# EAGLE design single100 (EAGLE 6.6.0)
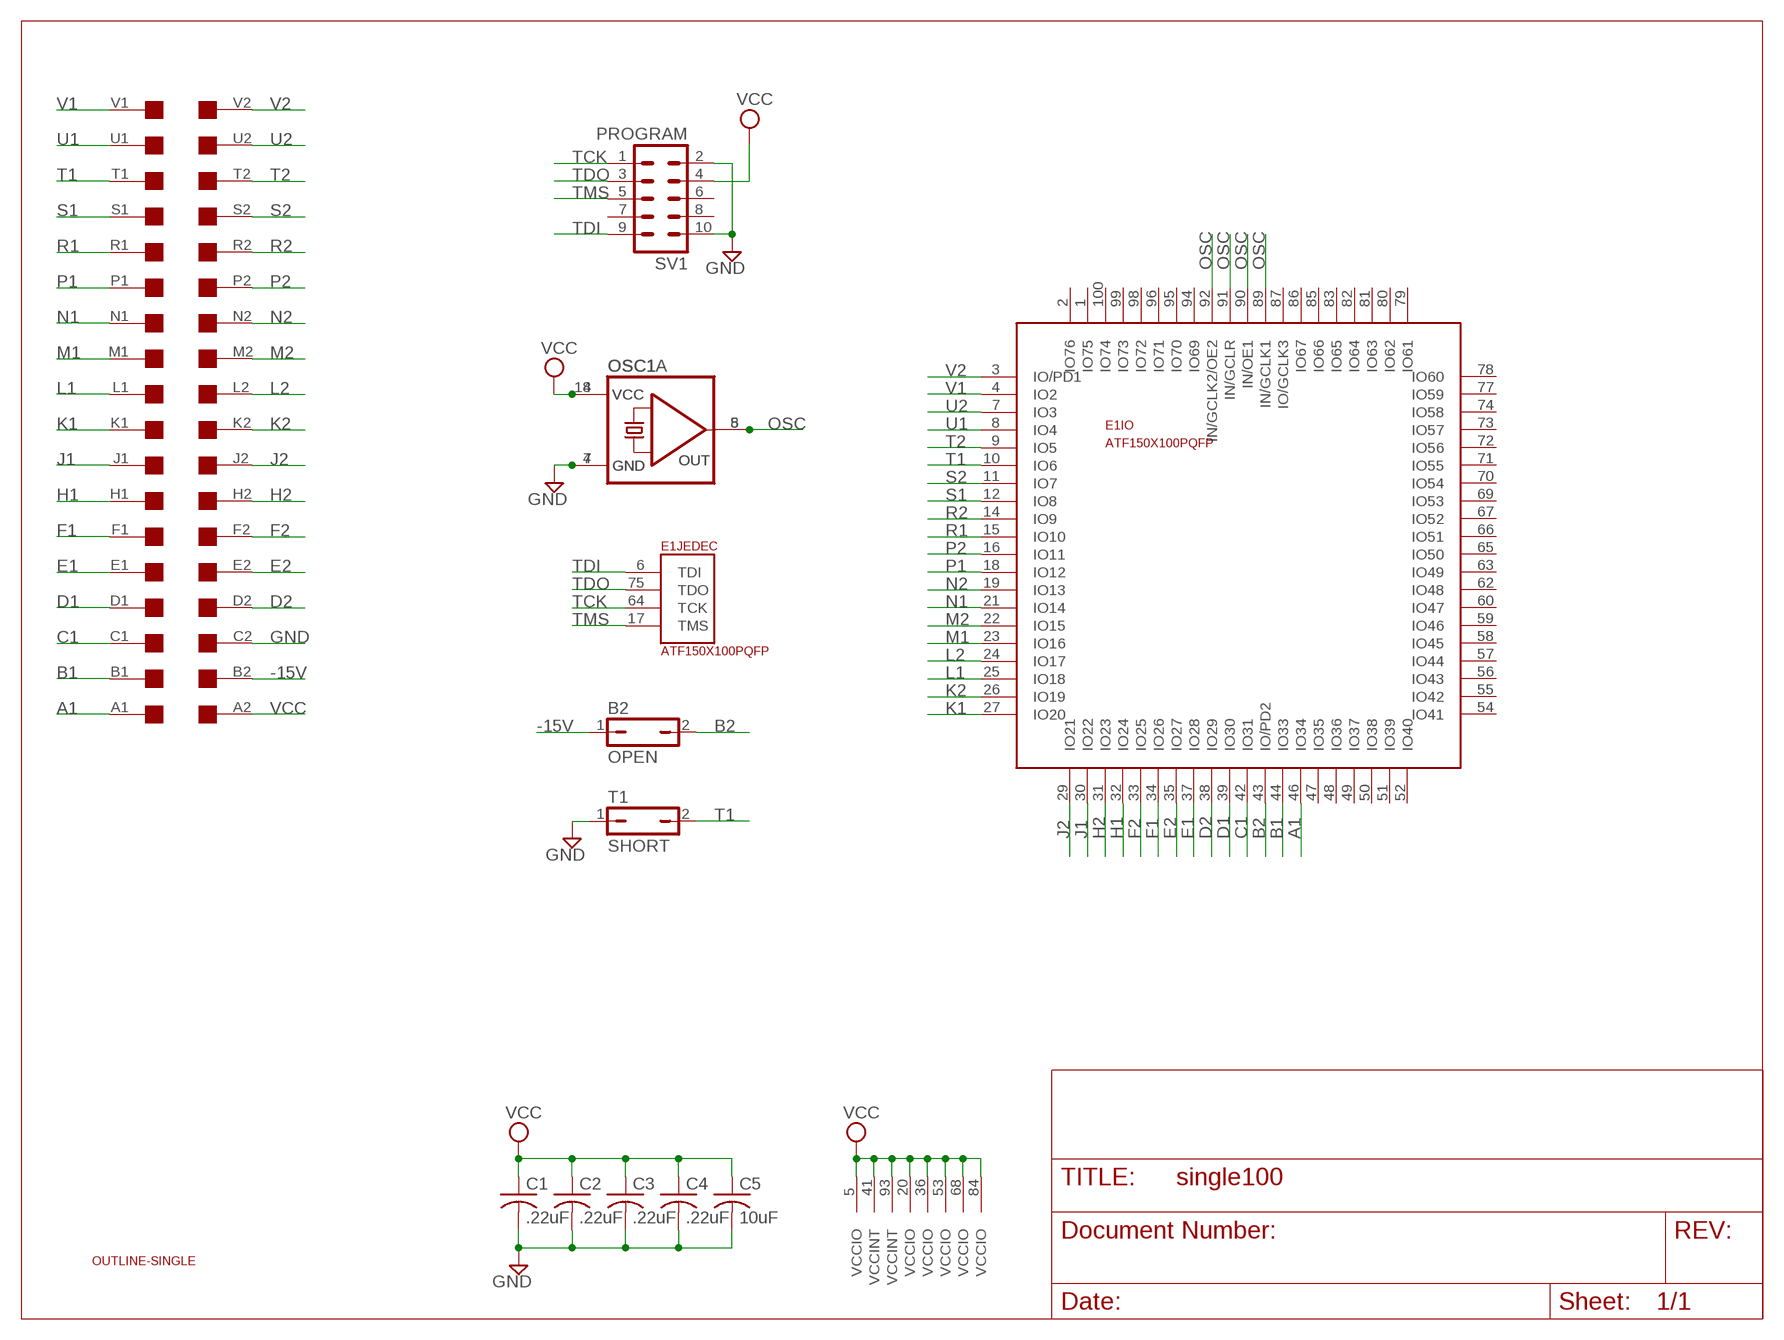
[diagram p0: schematic, sheet 1]

## Parts
B2  OPEN  JP1Q  [JP1]
C1  .22uF  C-USC0805  [C0805]
C2  .22uF  C-USC0805  [C0805]
C3  .22uF  C-USC0805  [C0805]
C4  .22uF  C-USC0805  [C0805]
C5  10uF  C-USC0805  [C0805]
E1  ATF150X100PQFP  [PQFP-100]
OSC1  QG5460  [DIL08S]
OSC1A  QG5860  [DIL14S]
SV1  PROGRAM  ML10  [ML10]
T1  SHORT  JP1Q  [JP1]
U$1  OUTLINE-SINGLE  [SINGLE]
U$2  SINGLE  [EDGE-CON2]

## Nets
-15V: B2.1 U$2.B2
A1: E1.46(IO:IO34) U$2.A1
B1: E1.44(IO:IO33) U$2.B1
B2: B2.2 E1.43(IO:IO/PD2)
C1: E1.42(IO:IO31) U$2.C1
D1: E1.39(IO:IO30) U$2.D1
D2: E1.38(IO:IO29) U$2.D2
E1: E1.37(IO:IO28) U$2.E1
E2: E1.35(IO:IO27) U$2.E2
F1: E1.34(IO:IO26) U$2.F1
F2: E1.33(IO:IO25) U$2.F2
GND: C1.2 C2.2 C3.2 C4.2 C5.2 OSC1.4(GND) OSC1A.7(GND) SV1.2 SV1.10 T1.1 U$2.C2
H1: E1.32(IO:IO24) U$2.H1
H2: E1.31(IO:IO23) U$2.H2
J1: E1.30(IO:IO22) U$2.J1
J2: E1.29(IO:IO21) U$2.J2
K1: E1.27(IO:IO20) U$2.K1
K2: E1.26(IO:IO19) U$2.K2
L1: E1.25(IO:IO18) U$2.L1
L2: E1.24(IO:IO17) U$2.L2
M1: E1.23(IO:IO16) U$2.M1
M2: E1.22(IO:IO15) U$2.M2
N1: E1.21(IO:IO14) U$2.N1
N2: E1.19(IO:IO13) U$2.N2
OSC: E1.89(IO:IN/GCLK1) E1.90(IO:IN/OE1) E1.91(IO:IN/GCLR) E1.92(IO:IN/GCLK2/OE2) OSC1.5(OUT) OSC1A.8(OUT)
P1: E1.18(IO:IO12) U$2.P1
P2: E1.16(IO:IO11) U$2.P2
R1: E1.15(IO:IO10) U$2.R1
R2: E1.14(IO:IO9) U$2.R2
S1: E1.12(IO:IO8) U$2.S1
S2: E1.11(IO:IO7) U$2.S2
T1: E1.10(IO:IO6) T1.2 U$2.T1
T2: E1.9(IO:IO5) U$2.T2
TCK: E1.64(JEDEC:TCK) SV1.1
TDI: E1.6(JEDEC:TDI) SV1.9
TDO: E1.75(JEDEC:TDO) SV1.3
TMS: E1.17(JEDEC:TMS) SV1.5
U1: E1.8(IO:IO4) U$2.U1
U2: E1.7(IO:IO3) U$2.U2
V1: E1.4(IO:IO2) U$2.V1
V2: E1.3(IO:IO/PD1) U$2.V2
VCC: C1.1 C2.1 C3.1 C4.1 C5.1 E1.5(VCCIO) E1.20(VCCIO) E1.36(VCCIO) E1.41(VCCINT) E1.53(VCCIO) E1.68(VCCIO) E1.84(VCCIO) E1.93(VCCINT) OSC1.8(VCC) OSC1A.14(VCC) SV1.4 U$2.A2
Unconnected: E1.1(IO:IO75) E1.2(IO:IO76) E1.47(IO:IO35) E1.48(IO:IO36) E1.49(IO:IO37) E1.50(IO:IO38) E1.51(IO:IO39) E1.52(IO:IO40) E1.54(IO:IO41) E1.55(IO:IO42) E1.56(IO:IO43) E1.57(IO:IO44) E1.58(IO:IO45) E1.59(IO:IO46) E1.60(IO:IO47) E1.62(IO:IO48) E1.63(IO:IO49) E1.65(IO:IO50) E1.66(IO:IO51) E1.67(IO:IO52) E1.69(IO:IO53) E1.70(IO:IO54) E1.71(IO:IO55) E1.72(IO:IO56) E1.73(IO:IO57) E1.74(IO:IO58) E1.77(IO:IO59) E1.78(IO:IO60) E1.79(IO:IO61) E1.80(IO:IO62) E1.81(IO:IO63) E1.82(IO:IO64) E1.83(IO:IO65) E1.85(IO:IO66) E1.86(IO:IO67) E1.87(IO:IO/GCLK3) E1.94(IO:IO69) E1.95(IO:IO70) E1.96(IO:IO71) E1.98(IO:IO72) E1.99(IO:IO73) E1.100(IO:IO74) SV1.6 SV1.7 SV1.8

## Power pins joined to a net without a drawn wire
GND: E1.13(GND) E1.28(GND) E1.40(GND) E1.45(GND) E1.61(GND) E1.76(GND) E1.88(GND) E1.97(GND)

## Library data of the parts
B2 T1 = jumper:JP1Q: JUMPER
C1-C5 = rcl:C-US: CAPACITOR, American symbol
E1 = atmel-cpld:ATF150X100: ATF150x in 100 pin package.
OSC1 = crystal:QG5460: CRYSTAL RESONATOR; OC_FARNELL: unknown; OC_NEWARK: unknown
OSC1A = crystal:QG5860: CRYSTAL RESONATOR; OC_FARNELL: unknown; OC_NEWARK: unknown
SV1 = con-harting-ml:ML10: HARTING; OC_FARNELL: unknown; OC_NEWARK: unknown
U$1 = dec-con:OUTLINE-*: Board outlines for DEC boards.
U$2 = dec-con:SINGLE: Single-Height DEC board

## Net classes
1 Supply: width 0.711 mm

## Board
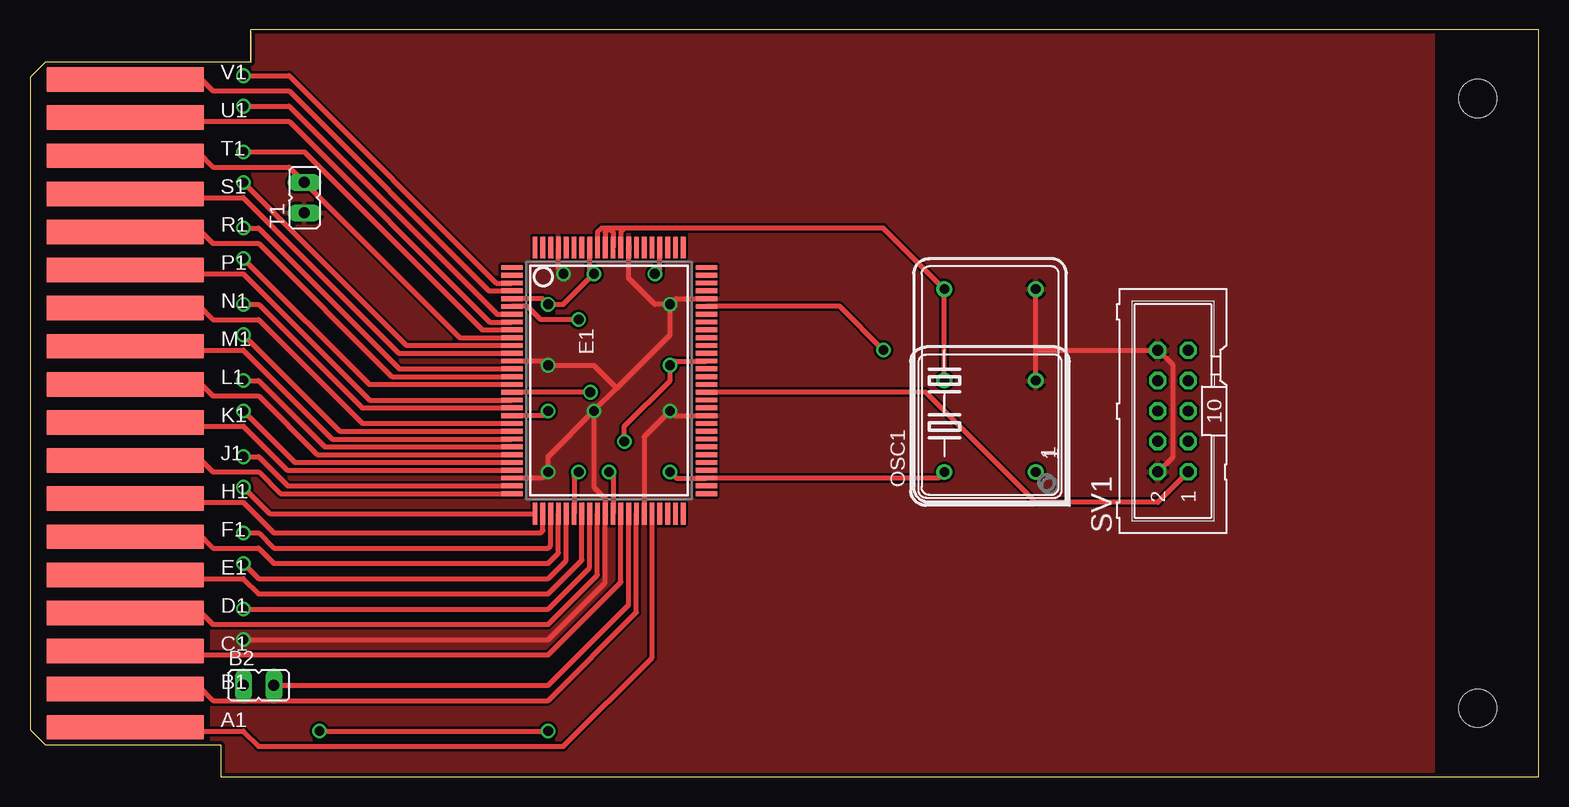
[diagram p1: board, top side]
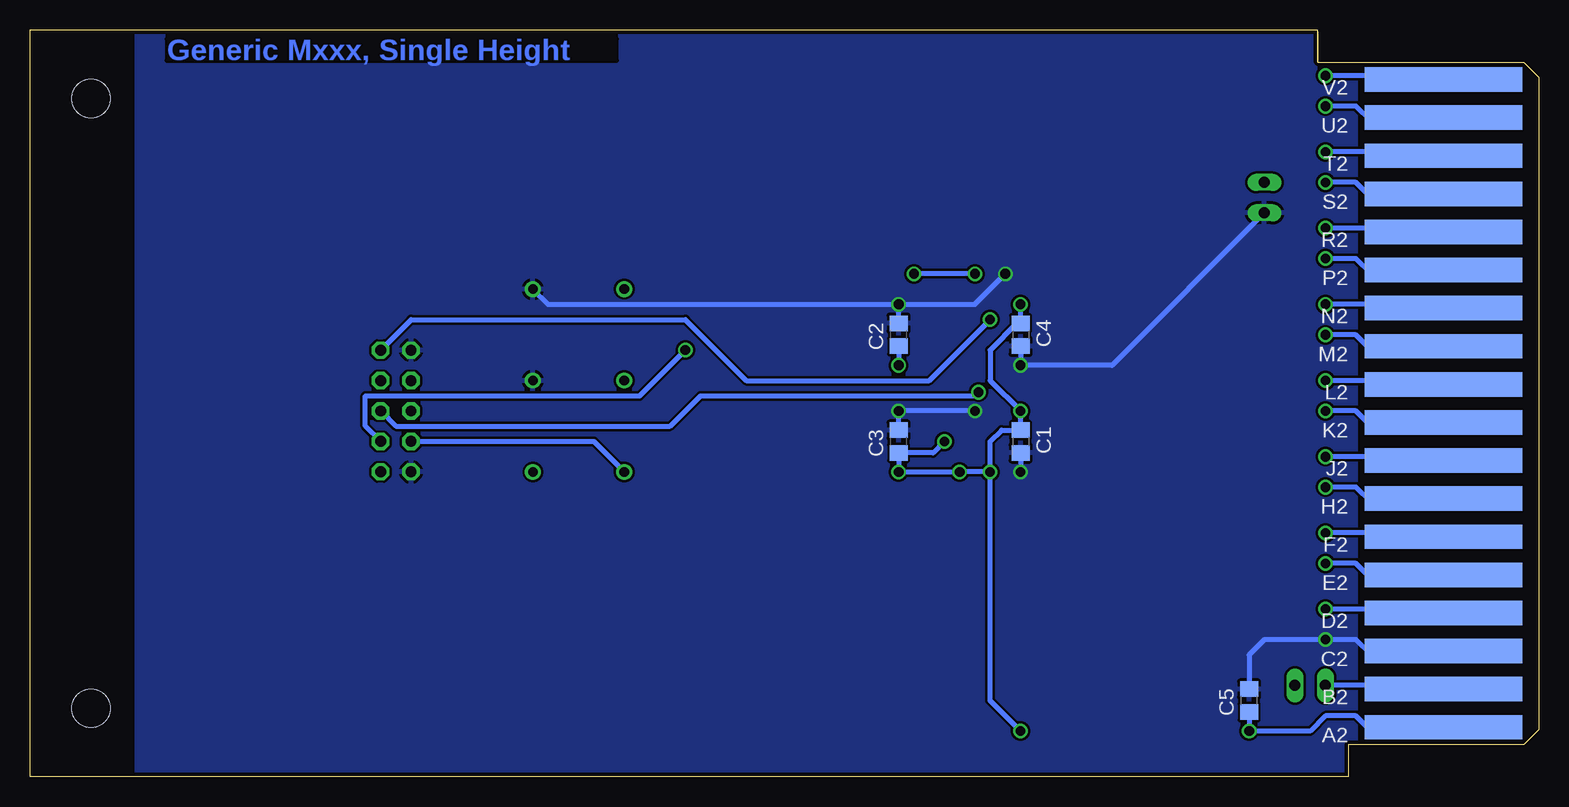
[diagram p2: board, bottom side, seen from below]

Size 125.73 x 62.23 mm. Coordinates in mm from the lower left corner, seen from the top.
Copper layers (1+16): Top 0.035mm / dielectric 1.5mm / Bottom 0.035mm
Design rules "16mils *": minimum track width 15mil, minimum drill 32mil, track to track 8mil, track to pad 8mil, pad to pad 8mil, via to via 10mil, smd to smd 8mil, copper to edge 13mil, drill to drill 10mil, minimum pad ring 10mil, minimum via ring 8mil, stop-mask expansion 0mil, vias tented up to drill 0mil, thermal gap 10mil

### Footprints (pad centres in the part's own frame; a part is rotated, then mirrored left to right if it is on the bottom)
JP1 = drill 0.914 long: 1 0,-1.27; 2 0,1.27
C0805 = smd 1.3 x 1.5: 1 -0.95,0; 2 0.95,0
PQFP-100 = smd 0.4 x 1.8: 1 -9.425,-8.1; 2 -8.775,-8.1; 3 -8.125,-8.1; 4 -7.475,-8.1; 5 -6.825,-8.1; 6 -6.175,-8.1; 7 -5.525,-8.1; 8 -4.875,-8.1; 9 -4.225,-8.1; 10 -3.575,-8.1; 11 -2.925,-8.1; 12 -2.275,-8.1; 13 -1.625,-8.1; 14 -0.975,-8.1; 15 -0.325,-8.1; 16 0.325,-8.1; 17 0.975,-8.1; 18 1.625,-8.1; 19 2.275,-8.1; 20 2.925,-8.1; 21 3.575,-8.1; 22 4.225,-8.1; 23 4.875,-8.1; 24 5.525,-8.1; 25 6.175,-8.1; 26 6.825,-8.1; 27 7.475,-8.1; 28 8.125,-8.1; 29 8.775,-8.1; 30 9.425,-8.1; 51 9.425,8.1; 52 8.775,8.1; 53 8.125,8.1; 54 7.475,8.1; 55 6.825,8.1; 56 6.175,8.1; 57 5.525,8.1; 58 4.875,8.1; 59 4.225,8.1; 60 3.575,8.1; 61 2.925,8.1; 62 2.275,8.1; 63 1.625,8.1; 64 0.975,8.1; 65 0.325,8.1; 66 -0.325,8.1; 67 -0.975,8.1; 68 -1.625,8.1; 69 -2.275,8.1; 70 -2.925,8.1; 71 -3.575,8.1; 72 -4.225,8.1; 73 -4.875,8.1; 74 -5.525,8.1; 75 -6.175,8.1; 76 -6.825,8.1; 77 -7.475,8.1; 78 -8.125,8.1; 79 -8.775,8.1; 80 -9.425,8.1 | smd 1.8 x 0.4: 31 11.1,-6.175; 32 11.1,-5.525; 33 11.1,-4.875; 34 11.1,-4.225; 35 11.1,-3.575; 36 11.1,-2.925; 37 11.1,-2.275; 38 11.1,-1.625; 39 11.1,-0.975; 40 11.1,-0.325; 41 11.1,0.325; 42 11.1,0.975; 43 11.1,1.625; 44 11.1,2.275; 45 11.1,2.925; 46 11.1,3.575; 47 11.1,4.225; 48 11.1,4.875; 49 11.1,5.525; 50 11.1,6.175; 81 -11.1,6.175; 82 -11.1,5.525; 83 -11.1,4.875; 84 -11.1,4.225; 85 -11.1,3.575; 86 -11.1,2.925; 87 -11.1,2.275; 88 -11.1,1.625; 89 -11.1,0.975; 90 -11.1,0.325; 91 -11.1,-0.325; 92 -11.1,-0.975; 93 -11.1,-1.625; 94 -11.1,-2.275; 95 -11.1,-2.925; 96 -11.1,-3.575; 97 -11.1,-4.225; 98 -11.1,-4.875; 99 -11.1,-5.525; 100 -11.1,-6.175
DIL08S = drill 0.813: 1 -3.81,-3.81; 4 3.81,-3.81; 5 3.81,3.81; 8 -3.81,3.81
DIL14S = drill 0.813: 1 -7.62,-3.81; 7 7.62,-3.81; 8 7.62,3.81; 14 -7.62,3.81
ML10 = drill 0.914 octagon: 1 -5.08,-1.27; 2 -5.08,1.27; 3 -2.54,-1.27; 4 -2.54,1.27; 5 0,-1.27; 6 0,1.27; 7 2.54,-1.27; 8 2.54,1.27; 9 5.08,-1.27; 10 5.08,1.27
SINGLE = hole 3.175: 120.65,56.515; 120.65,5.715
EDGE-CON2 = smd 13.106 x 2.032: A1 7.938,4.128; B1 7.938,7.303; C1 7.938,10.477; D1 7.938,13.652; E1 7.938,16.828; F1 7.938,20.003; H1 7.938,23.177; J1 7.938,26.352; K1 7.938,29.527; L1 7.938,32.703; M1 7.938,35.877; N1 7.938,39.053; P1 7.938,42.227; R1 7.938,45.403; S1 7.938,48.578; T1 7.938,51.752; U1 7.938,54.928; V1 7.938,58.102 | smd 13.106 x 2.032 bottom: A2 7.938,4.128; B2 7.938,7.303; C2 7.938,10.477; D2 7.938,13.652; E2 7.938,16.828; F2 7.938,20.003; H2 7.938,23.177; J2 7.938,26.352; K2 7.938,29.527; L2 7.938,32.703; M2 7.938,35.877; N2 7.938,39.053; P2 7.938,42.227; R2 7.938,45.403; S2 7.938,48.578; T2 7.938,51.752; U2 7.938,54.928; V2 7.938,58.102

### Placement (x,y rotation side)
B2  19.05,7.62 270 top
C1  43.18,27.94 270 bottom
C2  53.34,36.83 90 bottom
C3  53.34,27.94 90 bottom
C4  43.18,36.83 270 bottom
C5  24.13,6.35 90 bottom
E1  48.26,33.02 270 top
OSC1  80.01,29.21 90 top
OSC1A  80.01,33.02 90 top
SV1  95.25,30.48 90 top
T1  22.86,48.26 0 top
U$1  0,0 0 top
U$2  0,0 0 top

### Tracks (layer width: path | path; a pad name or v marks a point on that pad's centre or on a via)
-15V
  Bottom 0.406: U$2.B2 8.26,7.62 B2.1
A1
  Top 0.406: U$2.A1 8.26,3.81 17.78,3.81 19.05,2.54 44.45,2.54 51.84,9.93 E1.46
B1
  Top 0.406: U$2.B1 8.26,7.62 13.97,7.62 15.24,6.35 43.18,6.35 50.54,13.71 E1.44
B2
  Top 0.406: B2.2 43.18,7.62 49.89,14.32 E1.43
C1
  Top 0.406: U$2.C1 8.26,10.16 43.18,10.16 49.24,16.21 E1.42
D1
  Top 0.406: U$2.D1 8.26,13.97 13.97,13.97 15.24,12.7 43.18,12.7 47.29,16.8 E1.39
D2  (via drill 0.81)
  Top 0.406: v17.78,13.97 43.18,13.97 46.64,17.43 E1.38
  Bottom 0.406: U$2.D2 8.26,13.97 v17.78,13.97
E1
  Top 0.406: U$2.E1 8.26,16.51 17.78,16.51 19.05,15.24 43.18,15.24 45.99,18.05 E1.37
E2  (via drill 0.81)
  Top 0.406: v17.78,17.78 19.05,16.51 43.18,16.51 44.69,18.02 E1.35
  Bottom 0.406: U$2.E2 8.26,16.51 13.97,16.51 15.24,17.78 v17.78,17.78
F1
  Top 0.406: U$2.F1 8.26,20.32 13.97,20.32 15.24,19.05 19.05,19.05 20.32,17.78 43.18,17.78 44.04,18.64 E1.34
F2  (via drill 0.81)
  Top 0.406: v17.78,20.32 19.05,20.32 20.32,19.05 43.18,19.05 43.39,19.25 E1.33
  Bottom 0.406: U$2.F2 8.26,20.32 v17.78,20.32
GND  (via drill 0.81)
  Top 0.406: 83.82,35.56 OSC1A.7 | v17.78,11.43 43.18,11.43 47.94,16.18 E1.40 47.94,23.18 46.99,24.13 v46.99,30.48 | E1.61 53.73,30.09 v53.34,30.48 51.19,28.32 E1.45 | E1.76 53.82,39.84 v53.34,39.37 | E1.28 42.68,24.89 v43.18,25.4 43.18,26.67 v46.99,30.48 | E1.13 42.83,34.65 v43.18,34.29 46.99,34.29 48.9,32.38 | SV1.2 95.25,26.67 95.25,34.29 SV1.10 83.82,35.56 | OSC1.4 83.82,35.56 | 48.9,32.38 53.34,36.83 v53.34,39.37 | v53.34,39.37 52.07,39.37 49.89,41.55 E1.88 | v44.45,41.91 44.04,42.33 E1.97 | 48.9,32.38 v46.99,30.48
  Bottom 0.406: OSC1A.7 82.55,39.37 v53.34,39.37 | U$2.C2 8.26,10.16 13.97,10.16 15.24,11.43 v17.78,11.43 22.86,11.43 24.13,10.16 C5.2 | C1.2 v43.18,25.4 | C4.2 v43.18,34.29 35.56,34.29 T1.1 | C2.2 v53.34,39.37 | C3.2 v53.34,30.48 v46.99,30.48 | v53.34,39.37 46.99,39.37 v44.45,41.91
  pour Bottom: 15.24,0 15.24,62.23 116.84,62.23 116.84,0
  pour Top: 15.24,0 15.24,62.23 116.84,62.23 116.84,0
H1
  Top 0.406: U$2.H1 8.26,22.86 17.78,22.86 20.32,20.32 42.55,20.32 42.74,20.51 E1.32
H2  (via drill 0.81)
  Top 0.406: v17.78,24.13 19.99,21.92 E1.31
  Bottom 0.406: U$2.H2 8.26,22.86 13.97,22.86 15.24,24.13 v17.78,24.13
J1
  Top 0.406: U$2.J1 8.26,26.67 13.97,26.67 15.24,25.4 19.05,25.4 20.86,23.59 E1.30
J2  (via drill 0.81)
  Top 0.406: v17.78,26.67 19.05,26.67 21.48,24.25 E1.29
  Bottom 0.406: U$2.J2 8.26,26.67 v17.78,26.67
K1
  Top 0.406: U$2.K1 8.26,29.21 17.78,29.21 21.45,25.55 E1.27
K2  (via drill 0.81)
  Top 0.406: v17.78,30.48 22.07,26.2 E1.26
  Bottom 0.406: U$2.K2 8.26,29.21 13.97,29.21 15.24,30.48 v17.78,30.48
L1
  Top 0.406: U$2.L1 8.26,33.02 13.97,33.02 15.24,31.75 19.05,31.75 23.96,26.84 E1.25
L2  (via drill 0.81)
  Top 0.406: v17.78,33.02 19.05,33.02 24.58,27.5 E1.24
  Bottom 0.406: U$2.L2 8.26,33.02 v17.78,33.02
M1
  Top 0.406: U$2.M1 8.26,35.56 17.78,35.56 25.2,28.14 E1.23
M2  (via drill 0.81)
  Top 0.406: v17.78,36.83 25.82,28.8 E1.22
  Bottom 0.406: U$2.M2 8.26,35.56 13.97,35.56 15.24,36.83 v17.78,36.83
N1
  Top 0.406: U$2.N1 8.26,39.37 13.97,39.37 15.24,38.1 19.05,38.1 27.71,29.45 E1.21
N2  (via drill 0.81)
  Top 0.406: v17.78,39.37 19.05,39.37 27.68,30.75 E1.19
  Bottom 0.406: U$2.N2 8.26,39.37 v17.78,39.37
OSC
  Top 0.406: 49.53,45.72 71.12,45.72 OSC1A.8 OSC1.5 | 49.53,45.72 48.26,45.72 | 48.26,45.72 47.63,45.72 47.29,45.38 E1.92 | 48.26,45.72 47.94,45.4 E1.91 | 48.26,45.72 48.59,45.4 E1.90 | 49.53,45.72 49.24,45.42 E1.89
P1
  Top 0.406: U$2.P1 8.26,41.91 17.78,41.91 28.3,31.39 E1.18
P2  (via drill 0.81)
  Top 0.406: v17.78,43.18 28.27,32.7 E1.16
  Bottom 0.406: U$2.P2 8.26,41.91 13.97,41.91 15.24,43.18 v17.78,43.18
R1
  Top 0.406: U$2.R1 8.26,45.72 13.97,45.72 15.24,44.45 19.05,44.45 30.16,33.34 E1.15
R2  (via drill 0.81)
  Top 0.406: v17.78,45.72 19.05,45.72 30.78,33.99 E1.14
  Bottom 0.406: U$2.R2 8.26,45.72 v17.78,45.72
S1
  Top 0.406: U$2.S1 8.26,48.26 17.78,48.26 30.75,35.3 E1.12
S2  (via drill 0.81)
  Top 0.406: v17.78,49.53 31.37,35.95 E1.11
  Bottom 0.406: U$2.S2 8.26,48.26 13.97,48.26 15.24,49.53 v17.78,49.53
T1
  Top 0.406: U$2.T1 8.26,52.07 13.97,52.07 15.24,50.8 21.59,50.8 T1.2 35.8,36.59 E1.10
T2  (via drill 0.81)
  Top 0.406: v17.78,52.07 22.86,52.07 37.69,37.24 E1.9
  Bottom 0.406: U$2.T2 8.26,52.07 v17.78,52.07
TCK
  Top 0.406: SV1.1 93.98,22.86 83.82,22.86 74.64,32.05 E1.64
TDI  (via drill 0.81)
  Top 0.406: v45.72,38.1 42.55,38.1 41.45,39.2 E1.6
  Bottom 0.406: SV1.9 93.98,38.1 71.12,38.1 66.04,33.02 50.8,33.02 v45.72,38.1
TDO  (via drill 0.81)
  Top 0.406: v71.12,35.56 67.49,39.2 E1.75
  Bottom 0.406: SV1.3 97.79,29.21 97.79,31.75 74.93,31.75 v71.12,35.56
TMS  (via drill 0.81)
  Top 0.406: v46.7,32.05 E1.17
  Bottom 0.406: SV1.5 95.25,29.21 72.39,29.21 69.85,31.75 46.99,31.75 v46.7,32.05
U1
  Top 0.406: U$2.U1 8.26,54.61 21.59,54.61 38.31,37.9 E1.8
U2  (via drill 0.81)
  Top 0.406: v17.78,55.88 21.59,55.88 38.93,38.55 E1.7
  Bottom 0.406: U$2.U2 8.26,54.61 13.97,54.61 15.24,55.88 v17.78,55.88
V1
  Top 0.406: U$2.V1 8.26,58.42 13.97,58.42 15.24,57.15 21.59,57.15 38.25,40.49 E1.4
V2  (via drill 0.81)
  Top 0.406: v17.78,58.42 21.59,58.42 38.87,41.15 E1.3
  Bottom 0.406: U$2.V2 8.26,58.42 v17.78,58.42
VCC  (via drill 0.81)
  Top 0.406: v53.34,25.4 53.85,24.89 E1.53 75.7,24.89 OSC1.8 | E1.68 53.7,34.65 v53.34,34.29 53.34,33.02 49.53,29.21 v49.53,27.94 | v43.18,30.48 42.8,30.09 E1.20 | E1.5 42.71,39.84 v43.18,39.37 44.45,39.37 v46.99,41.91 46.64,42.27 E1.93 | v45.72,25.4 45.34,25.02 E1.36 | v48.26,25.4 48.59,25.07 E1.41 | v24.13,3.81 v43.18,3.81 | v52.07,41.91 52.49,42.33 E1.84
  Bottom 0.406: U$2.A2 8.26,3.81 13.97,3.81 15.24,5.08 17.78,5.08 19.05,3.81 v24.13,3.81 C5.1 | v43.18,39.37 C4.1 43.5,37.78 45.72,35.56 45.72,33.02 v43.18,30.48 C1.1 44.77,28.89 45.72,27.94 v45.72,25.4 | C2.1 v53.34,34.29 | SV1.4 78.74,27.94 OSC1.8 | v45.72,25.4 v48.26,25.4 v53.34,25.4 C3.1 50.48,26.99 v49.53,27.94 | v43.18,3.81 45.72,6.35 v45.72,25.4 | v46.99,41.91 v52.07,41.91

### Text on the board
Bottom: Generic Mxxx, Single Height